# Altium schematic sheet Схема приинципиальная.SchDoc
size 594 x 420 mm; Address1: Address1; Address2: Address2; Address3: Address3; Address4: Address4; DocumentNumber: АБВГ.123456.001 Э3; SheetNumber: 1; Scale: 1:1; DocumentType: Схема электрическая принципиальная; FirstReferrence: АБВГ.123456.001
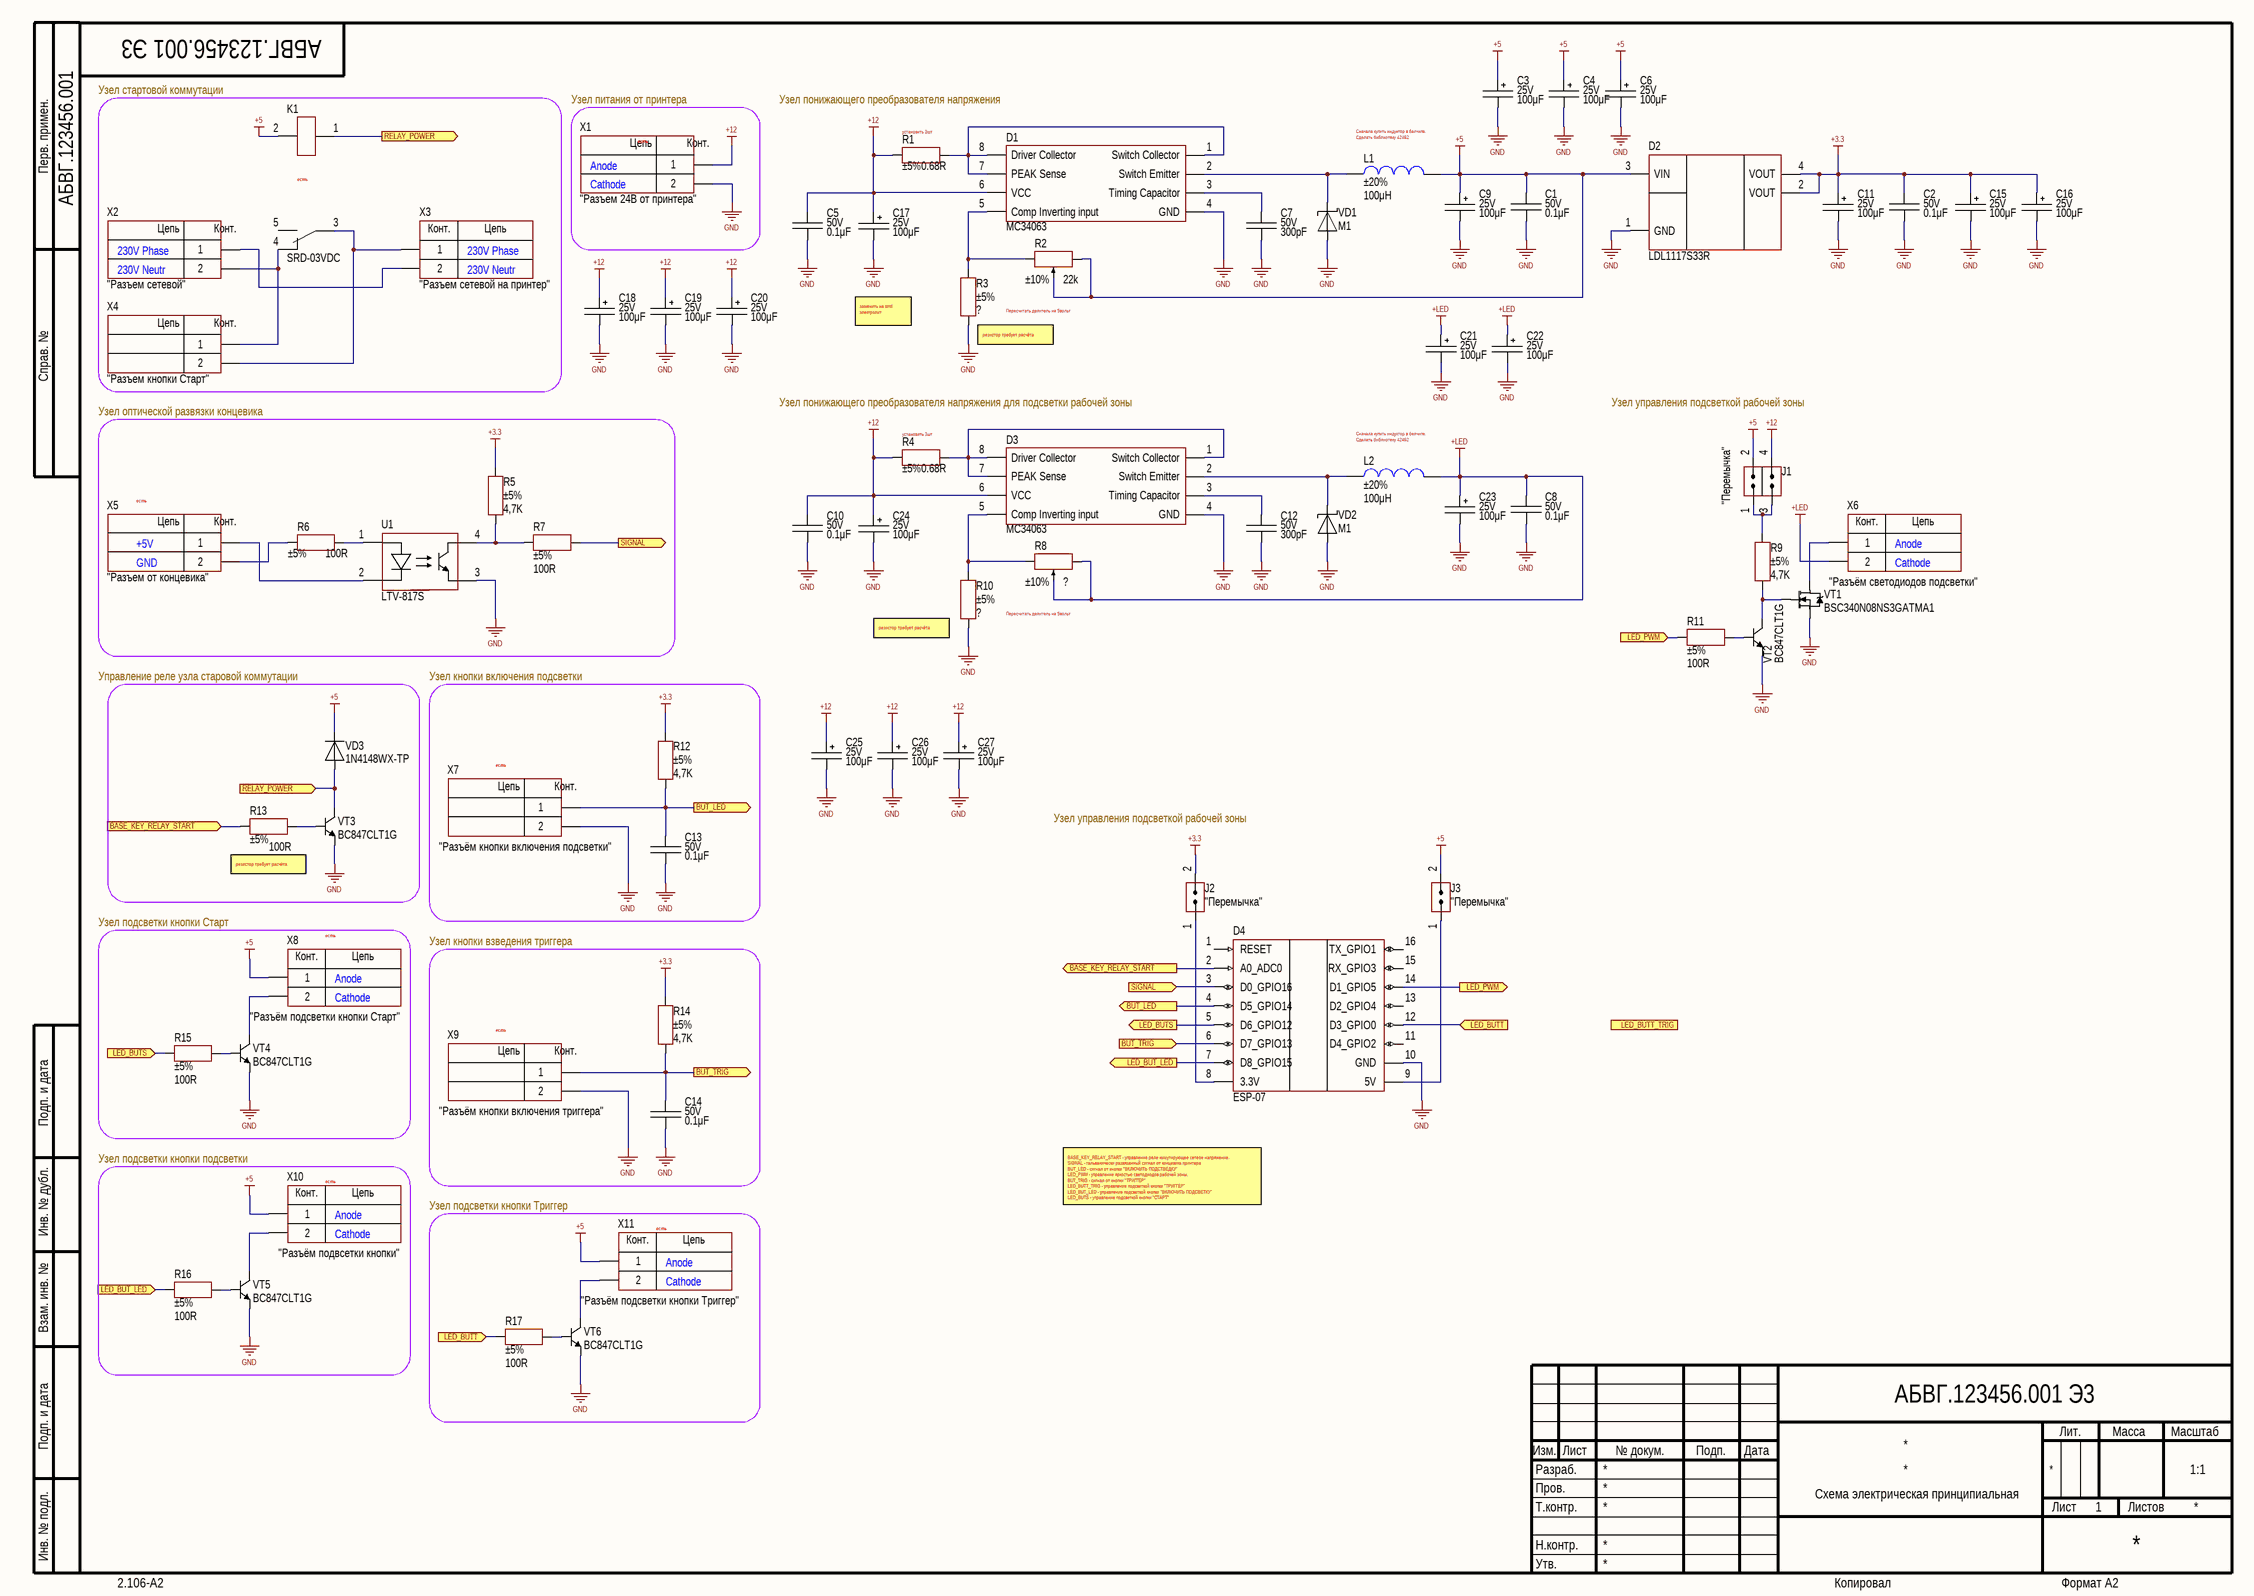
[diagram p0: Схема приинципиальная.SchDoc]

## Parts
C1  value 0.1μF  Voltage: 50V  [CAP: 0603]
C2  value 0.1μF  Voltage: 50V  [CAP: 0603]
C3  value 100μF  Voltage: 25V  [CAP: D6.3C2.5H11]
C4  value 100μF  Voltage: 25V  [CAP: D6.3C2.5H11]
C5  value 0.1μF  Voltage: 50V  [CAP: 0603]
C6  value 100μF  Voltage: 25V  [CAP: D6.3C2.5H11]
C7  value 300pF  Voltage: 50V  [CAP: 0603]
C8  value 0.1μF  Voltage: 50V  [CAP: 0603]
C9  value 100μF  Voltage: 25V  [CAP: D6.3C2.5H11]
C10  value 0.1μF  Voltage: 50V  [CAP: 0603]
C11  value 100μF  Voltage: 25V  [CAP: D6.3C2.5H11]
C12  value 300pF  Voltage: 50V  [CAP: 0603]
C13  value 0.1μF  Voltage: 50V  [CAP: 0603]
C14  value 0.1μF  Voltage: 50V  [CAP: 0603]
C15  value 100μF  Voltage: 25V  [CAP: D6.3C2.5H11]
C16  value 100μF  Voltage: 25V  [CAP: D6.3C2.5H11]
C17  value 100μF  Voltage: 25V  [CAP: D6.3C2.5H11]
C18  value 100μF  Voltage: 25V  [CAP: D6.3C2.5H11]
C19  value 100μF  Voltage: 25V  [CAP: D6.3C2.5H11]
C20  value 100μF  Voltage: 25V  [CAP: D6.3C2.5H11]
C21  value 100μF  Voltage: 25V  [CAP: D6.3C2.5H11]
C22  value 100μF  Voltage: 25V  [CAP: D6.3C2.5H11]
C23  value 100μF  Voltage: 25V  [CAP: D6.3C2.5H11]
C24  value 100μF  Voltage: 25V  [CAP: D6.3C2.5H11]
C25  value 100μF  Voltage: 25V  [CAP: D6.3C2.5H11]
C26  value 100μF  Voltage: 25V  [CAP: D6.3C2.5H11]
C27  value 100μF  Voltage: 25V  [CAP: D6.3C2.5H11]
D1  (no value)  [8-SOIC]
D2  (no value)  [SOT223]
D3  (no value)  [8-SOIC]
D4  PartNumber: ESP-07  [ESP8266MOD D1 mini]
J1  CommentText: "Перемычка"  [CON: JUMPER x2]
J2  CommentText: "Перемычка"  [CON: JUMPER x1]
J3  CommentText: "Перемычка"  [CON: JUMPER x1]
K1  PartNumber: SRD-03VDC  [REL: SRD-03VDC]
L1  value 100μH  Tolerance: ±20%  [CDRH]
L2  value 100μH  Tolerance: ±20%  [CDRH]
R1  value 0.68R  Tolerance: ±5%  [RES: 2512]
R2  value 22k  Tolerance: ±10%  [RES: 3296W]
R3  Tolerance: ±5%  [RES: 0603]
R4  value 0.68R  Tolerance: ±5%  [RES: 2512]
R5  value 4,7K  Tolerance: ±5%  [RES: 0603]
R6  value 100R  Tolerance: ±5%  [RES: 0603]
R7  value 100R  Tolerance: ±5%  [RES: 0603]
R8  Tolerance: ±10%  [RES: 3296W]
R9  value 4,7K  Tolerance: ±5%  [RES: 0603]
R10  Tolerance: ±5%  [RES: 0603]
R11  value 100R  Tolerance: ±5%  [RES: 0603]
R12  value 4,7K  Tolerance: ±5%  [RES: 0603]
R13  value 100R  Tolerance: ±5%  [RES: 0603]
R14  value 4,7K  Tolerance: ±5%  [RES: 0603]
R15  value 100R  Tolerance: ±5%  [RES: 0603]
R16  value 100R  Tolerance: ±5%  [RES: 0603]
R17  value 100R  Tolerance: ±5%  [RES: 0603]
U1  PartNumber: LTV-817S  [4-DIP]
VD1  PartNumber: M1  [DIODE: SMA]
VD2  PartNumber: M1  [DIODE: SMA]
VD3  PartNumber: 1N4148WX-TP  [DIODE: SMA]
VT1  PartNumber: BSC340N08NS3GATMA1  [DPAK]
VT2  PartNumber: BC847CLT1G  [SOT23]
VT3  PartNumber: BC847CLT1G  [SOT23]
VT4  PartNumber: BC847CLT1G  [SOT23]
VT5  PartNumber: BC847CLT1G  [SOT23]
VT6  PartNumber: BC847CLT1G  [SOT23]
X1  CommentText: "Разъем 24В от принтера"  [CON: DG301-5.0-02P-12-00AH]
X2  CommentText: "Разъем сетевой"  [CON: DG301-5.0-02P-12-00AH]
X3  CommentText: "Разъем сетевой на принтер"  [CON: DG301-5.0-02P-12-00AH]
X4  CommentText: "Разъем кнопки Старт"  [CON: DG301-5.0-02P-12-00AH]
X5  CommentText: "Разъем от концевика"  [CON: DG301-5.0-02P-12-00AH]
X6  CommentText: "Разъём светодиодов подсветки"  [CON: DG301-5.0-02P-12-00AH]
X7  CommentText: "Разъём кнопки включения подсветки"  [CON: DG301-5.0-02P-12-00AH]
X8  CommentText: "Разъём подсветки кнопки Старт"  [CON: DG301-5.0-02P-12-00AH]
X9  CommentText: "Разъём кнопки включения триггера"  [CON: DG301-5.0-02P-12-00AH]
X10  CommentText: "Разъём подвсетки кнопки"  [CON: DG301-5.0-02P-12-00AH]
X11  CommentText: "Разъём подсветки кнопки Триггер"  [CON: DG301-5.0-02P-12-00AH]

## Blocks framed on the sheet
Узел кнопки включения подсветки: C13 R12 X7
Узел кнопки взведения триггера: C14 R14 X9

## Ports
BASE_KEY_RELAY_START (in), BASE_KEY_RELAY_START (out), BUT_LED (out), BUT_TRIG (in), BUT_TRIG (out), LED_BUT_LED (in), LED_BUT_LED (out), LED_BUTS (in), LED_BUTS (out), LED_BUTT (in), LED_BUTT_TRIG (out), LED_PWM (in), LED_PWM (out), RELAY_POWER (in), RELAY_POWER (out), SIGNAL (in), SIGNAL (out)

## Nets
+3.3: C2.2 C11.1 C15.1 C16.1 D2.2(VOUT) D2.4(VOUT) J2.2(IN) R5.2 R12.2 R14.2
+5: C1.2 C3.1 C4.1 C6.1 C9.1 D2.3(VIN) J1.2(IN) J3.2(IN) K1.2 L1.1 R2.1 R2.2 VD3.2 X8.1 X10.1 X11.1
+12: C5.2 C10.2 C17.1 C18.1 C19.1 C20.1 C24.1 C25.1 C26.1 C27.1 D1.6(VCC) D3.6(VCC) J1.4(IN) R1.1 R4.1 X1.1
+LED: C8.2 C21.1 C22.1 C23.1 L2.1 R8.1 R8.2 X6.2
GND: C1.1 C2.1 C3.2 C4.2 C5.1 C6.2 C7.1 C8.1 C9.2 C10.1 C11.2 C12.1 C13.1 C14.1 C15.2 C16.2 C17.2 C18.2 C19.2 C20.2 C21.2 C22.2 C23.2 C24.2 C25.2 C26.2 C27.2 D1.4(GND) D2.1(GND) D3.4(GND) D4.10(GND) R3.1 R10.1 U1.3(E) VD1.1 VD2.1 VT1.3(S) VT2.2(E) VT3.2(E) VT4.2(E) VT5.2(E) VT6.2(E) X1.2 X7.2 X9.2
BASE_KEY_RELAY_START: D4.2(A0_ADC0) R13.2 ; port BASE_KEY_RELAY_START
BUT_LED: C13.2 D4.4(D5_GPIO14) R12.1 X7.1 ; port BUT_LED
BUT_TRIG: C14.2 D4.6(D7_GPIO13) R14.1 X9.1 ; port BUT_TRIG
LED_BUT_LED: D4.7(D8_GPIO15) R16.2 ; port LED_BUT_LED
LED_BUTS: D4.5(D6_GPIO12) R15.2 ; port LED_BUTS
LED_BUTT: D4.12(D3_GPIO0) R17.2 ; port LED_BUTT
LED_PWM: D4.14(D1_GPIO5) R11.2 ; port LED_PWM
RELAY_POWER: K1.1 VD3.1 VT3.3(C) ; port RELAY_POWER
SIGNAL: D4.3(D0_GPIO16) R7.1 ; port SIGNAL
NetC7_2: C7.2 D1.3(Timing_Capacitor)
NetC12_2: C12.2 D3.3(Timing_Capacitor)
NetD1_1: D1.1(Switch_Collector) D1.7(PEAK_Sense) D1.8(Driver_Collector) R1.2
NetD1_2: D1.2(Switch_Emitter) L1.2 VD1.2
NetD1_5: D1.5(Comp_Inverting_input) R2.3 R3.2
NetD3_1: D3.1(Switch_Collector) D3.7(PEAK_Sense) D3.8(Driver_Collector) R4.2
NetD3_2: D3.2(Switch_Emitter) L2.2 VD2.2
NetD3_5: D3.5(Comp_Inverting_input) R8.3 R10.2
NetD4_8: D4.8(3.3V) J2.1(IN)
NetD4_9: D4.9(5V) J3.1(IN)
NetJ1_1: J1.1(IN) J1.3(IN) R9.2
NetK1_3: K1.3 X3.1 X4.2
NetK1_4: K1.4 X2.2 X4.1
NetR5_1: R5.1 R7.2 U1.4(C)
NetR6_1: R6.1 X5.2
NetR6_2: R6.2 U1.1(A)
NetR9_1: R9.1 VT1.1(G) VT2.3(C)
NetR11_1: R11.1 VT2.1(B)
NetR13_1: R13.1 VT3.1(B)
NetR15_1: R15.1 VT4.1(B)
NetR16_1: R16.1 VT5.1(B)
NetR17_1: R17.1 VT6.1(B)
NetU1_2: U1.2(C) X5.1
NetVT1_2: VT1.2(D) X6.1
NetVT4_3: VT4.3(C) X8.2
NetVT5_3: VT5.3(C) X10.2
NetVT6_3: VT6.3(C) X11.2
NetX2_1: X2.1 X3.2

Not connected (* = marked no-connect by the designer): D4 1(RESET) 11(D4_GPIO2) 13(D2_GPIO4) 15(RX_GPIO3) 16(TX_GPIO1); K1 5

## Notes on the sheet
- Узел стартовой коммутации
- Узел питания от принтера
- Узел понижающего преобразователя напряжения
- Anode
- есть
- (near R1) установить 3шт
- (near L1) Сначала купить индуктор в белчипе.
  Сделать библиотеку 42492
- (near K1) есть
- Cathode
- 230V Phase
- 230V Neutr
- Пересчитать делитель на 5вольт
- заменить на smd электролит
- (near R3) резистор требует расчёта
- Узел понижающего преобразователя напряжения для подсветки рабочей зоны
- Узел управления подсветкой рабочей зоны
- Узел оптической развязки концевика
- (near R4) установить 3шт
- (near L2) Сначала купить индуктор в белчипе.
  Сделать библиотеку 42492
- +5V
- GND
- (near R10) резистор требует расчёта
- Управление реле узла старовой коммутации
- резистор требует расчёта
- Узел подсветки кнопки Старт
- Узел подсветки кнопки подсветки
- Узел подсветки кнопки Триггер
- BASE_KEY_RELAY_START - управление реле кммутирующее сетеое напряжение.
  SIGNAL - гальванически развязанный сигнал от концевика принтера
  BUT_LED - сигнал от кнопки "ВКЛЮЧИТЬ ПОДСТВЕДКУ"
  LED_PWM - управление яркостью светодиодов рабочей зоны.
  BUT_TRIG - сигнал от кнопки "ТРИГГЕР"
  LED_BUTT_TRIG - управление подсветкой кнопки "ТРИГГЕР"
  LED_BUT_LED - управление подсветкой кнопки "ВКЛЮЧИТЬ ПОДСВЕТКУ"
  LED_BUTS - управление подсветкой кнопки "СТАРТ"
- Перв. примен.
- Справ. №
- Подп. и дата
- Инв. № дубл.
- Взам. инв. №
- Разраб.
- Изм.
- Лист
- № докум.
- Подп.
- Дата
- Лит.
- Масса
- Масштаб
- Пров.
- Т.контр.
- Листов
- Инв. № подл.
- Утв.
- Н.контр.
- 2.106-A2
- Копировал
- Формат А2
- (in symbol Connector_terminal_2pin) Цепь; Конт.

## Library data of the parts
C1 C2 C5 C8 C10 C13 C14 = Ceramic_0603: Manufacturer: Yageo; PartNumber: CC0603KRX7R7BB104; ValueManufacturerPartNumber: Ceramic capacitor, 0.1μF, X7R, ±10%, 50V, 0603, -55...+125°C; TypeCapacitor: Ceramic capacitor; Tolerance: ±10%; TypeDielectric: X7R; Package: 0603; HelpURL: https://www.digikey.com/product-detail/en/yageo/CC0603KRX7R7BB104/311-1088-1-ND/302998; Temperature: -55...+125°C
C3 C4 C6 C9 C11 C15-C27 = Aluminium: Manufacturer: Wurth; PartNumber: 860080475013; ValueManufacturerPartNumber: Aluminium capacitor, 100μF, 25V, ±20%, 54mOhm, 14x10x5 mm, -55...+105°C; TypeCapacitor: Aluminium capacitor; Tolerance: ±20%; Impedance: 54mOhm; Package: 14x10x5 mm; HelpURL: https://www.digikey.com/product-detail/en/wurth-electronics-inc/860080475013/732-9029-1-ND/5728972; Temperature: -55...+105°C
C7 C12 = Ceramic_0603: Manufacturer: Samsung; PartNumber: 01584; ValueManufacturerPartNumber: Ceramic capacitor, 300pF, X7R, ±10%, 50V, 0603, -55...+125°C; TypeCapacitor: Ceramic capacitor; Tolerance: ±10%; TypeDielectric: X7R; Package: 0603; HelpURL: https://belchip.by/product/?selected_product=01584; Temperature: -55...+125°C
D1 D3 = MC34063: DC TO DC CONVERTER / CONTROLLER; Manufacturer: UTC; ValueManufacturerPartNumber: DC TO DC CONVERTER, max supply 40V, Open drain, -40...+105°C, 8-SOIC; VoltageInput: max supply 40V; OutputType: Open drain; HelpURL: https://belchip.by/product/?selected_product=18919; Package: 8-SOIC; ComponentType: DC TO DC CONVERTER; Temperature: -40...+105°C; PartNumber: MC34063
D2 = LDL1117S33R: Linear voltage regulator; Manufacturer: STMicroelectronics; ValueManufacturerPartNumber: Linear voltage regulator, input 3.9...18V, 0.6V, output 3.3V, 1.2A, -40...+85°C, SOT223; VoltageInput: input 3.9...18V; MaxDropout: 0.6V; CurrentOutput: 1.2A; VoltageOutput: output 3.3V; HelpURL: https://www.digikey.com/product-detail/en/stmicroelectronics/LDL1117S33R/497-17239-1-ND/7102079; Package: SOT223; ComponentType: Linear voltage regulator; Temperature: -40...+85°C; PartNumber: LDL1117S33R
D4 = ESP8266MOD D1 mini: module; Manufacturer: Espressif Systems; ValueManufacturerPartNumber: Wi-Fi module, 802.11 b/g/n, 8 bit, SDIO/SPI/UART, -40...+85°C, 21x16mm; Core: 8 bit; TypeInterface: SDIO/SPI/UART; TypeStandart: 802.11 b/g/n; HelpURL: https://www.chipdip.ru/product/esp-07; Package: 21x16mm; ComponentType: Wi-Fi module; Temperature: -40...+85°C
J1 = Jumper_double
J2 J3 = Jumper_single
K1 = Relay_SRD-03VDC: Manufacturer: Ningbo Songle; ValueManufacturerPartNumber: Electromechanics relay, 3VDC, 250VAC, 10A, 1NO, -40...+85°C; TypeRelay: Electromechanics relay; VoltageMax: 250VAC; VoltageControlCoil: 3VDC; MaxCurrent: 10A; Package: 1NO; HelpURL: https://lcsc.com/product-detail/Relays_SRD-03VDC-SL-C_C24585.html; Temperature: -40...+85°C
L1 L2 = Inductor_CDRH: Manufacturer: Bourns; ValueManufacturerPartNumber: Fixed inductor, 100μH, ±20%, CDRH101R, 3A, -40...+150°C; TypeInductor: Fixed inductor; MaxCurrent: 3A; PartNumber: CDRH; Package: CDRH101R; HelpURL: https://aliexpress.ru/item/32956142172.html?spm=a2g0s.9042311.0.0.f06533edih9Buf; Temperature: -40...+150°C
R1 R4 = Resistor_2512: Manufacturer: Yageo; PartNumber: RC2512JK-07100RL; ValueManufacturerPartNumber: Resistor film, 0.68R, ±5%, 2512, 1W, -55...+125°C; TypeResistor: Resistor film; Power: 1W; Package: 2512; HelpURL: https://www.digikey.com/product-detail/en/yageo/RC2512JK-07100RL/YAG3393CT-ND/5962215; Temperature: -55...+125°C
R2 = Trimmer: Manufacturer: Bourns; PartNumber: 3296W-1-103LF; ValueManufacturerPartNumber: Resistor film, 22k, ±10%, 3296W, 0.5W, -55...+125°C; TypeResistor: Resistor film; Power: 0.5W; Package: 3296W; HelpURL: https://www.digikey.com/product-detail/en/bourns-inc/3296W-1-103LF/3296W-103LF-ND/1088045; Temperature: -55...+125°C
R3 R10 = Resistor_0603: Manufacturer: Yageo; PartNumber: RC0603JR-07100RL; ValueManufacturerPartNumber: Resistor film, ?, ±5%, 0603, 0.1W, -55...+125°C; TypeResistor: Resistor film; Power: 0.1W; Package: 0603; HelpURL: https://www.digikey.com/product-detail/en/yageo/RC0603JR-07100RL/311-100GRCT-ND/729644; Temperature: -55...+125°C; Value: ?
R5 R9 R12 R14 = Resistor_0603: Manufacturer: Yageo; PartNumber: RC0603JR-07100RL; ValueManufacturerPartNumber: Resistor film, 4,7K, ±5%, 0603, 0.1W, -55...+125°C; TypeResistor: Resistor film; Power: 0.1W; Package: 0603; HelpURL: https://www.digikey.com/product-detail/en/yageo/RC0603JR-07100RL/311-100GRCT-ND/729644; Temperature: -55...+125°C
R6 R7 R11 R13 R15-R17 = Resistor_0603: Manufacturer: Yageo; PartNumber: RC0603JR-07100RL; ValueManufacturerPartNumber: Resistor film, 100R, ±5%, 0603, 0.1W, -55...+125°C; TypeResistor: Resistor film; Power: 0.1W; Package: 0603; HelpURL: https://www.digikey.com/product-detail/en/yageo/RC0603JR-07100RL/311-100GRCT-ND/729644; Temperature: -55...+125°C
R8 = Trimmer: Manufacturer: Bourns; PartNumber: 3296W-1-103LF; ValueManufacturerPartNumber: Resistor film, ?, ±10%, 3296W, 0.5W, -55...+125°C; TypeResistor: Resistor film; Power: 0.5W; Package: 3296W; HelpURL: https://www.digikey.com/product-detail/en/bourns-inc/3296W-1-103LF/3296W-103LF-ND/1088045; Temperature: -55...+125°C; Value: ?
U1 = LTV-817: Optoisolator; Manufacturer: Lite-On; ValueManufacturerPartNumber: IC optoisolator, 4µs/3µs, 5000Vrms, 35V, -40...+125°C, 4-SMD; Supply: 35V; DataRate: 4µs/3µs; Isolation: 5000Vrms; HelpURL: https://www.digikey.com/product-detail/en/lite-on-inc/LTV-817S/160-1367-5-ND/385837; Package: 4-SMD; ComponentType: IC optoisolator; Temperature: -40...+125°C
VD1 VD2 = Schottky_single: Manufacturer: Diodes Incorporated; ValueManufacturerPartNumber: Schottky diode, 50V, 1000mA, 1V, 15pF, SOD-123, -55...+150°C; TypeDiode: Schottky diode; Voltage: 50V; Current: 1000mA; VoltageDrop: 1V; RecoveryTime: 15pF; Package: SOD-123; HelpURL: https://www.chipdip.by/product/m1-diod?from=suggest_product; Temperature: -55...+150°C
VD3 = Diode_single: Manufacturer: Micro Commercial; ValueManufacturerPartNumber: Single diode, 75V, 150mA, 1V, 4ns, SOD-323, -55...+150°C; TypeDiode: Single diode; Voltage: 75V; Current: 150mA; VoltageDrop: 1V; RecoveryTime: 4ns; Package: SOD-323; HelpURL: https://www.digikey.com/product-detail/en/micro-commercial-co/1N4148WX-TP/1N4148WXTPMSCT-ND/717312; Temperature: -55...+150°C
VT1 = MOSFET_N_123: Manufacturer: Infineon Technologies; ValueManufacturerPartNumber: MOSFET N-channel transistor, 80V, 7A, 9.1nC, 2.5W, 34mOhm, 756pF, 8-TDSON, -55...+150°C; TypeTransistor: MOSFET N-channel transistor; VoltageDS: 80V; CurrentDS: 7A; RDS: 34mOhm; GateCharge: 9.1nC; InputCapacitor: 756pF; MaxPower: 2.5W; Package: 8-TDSON; HelpURL: https://www.digikey.com/product-detail/en/infineon-technologies/BSC340N08NS3GATMA1/BSC340N08NS3GATMA1TR-ND/2080655; Temperature: -55...+150°C
VT2-VT6 = BJT_NPN_132: Manufacturer: ON Semiconductor; ValueManufacturerPartNumber: NPN transistor, 45V, 100mA, 100MHz, 300mW, 0.6V, 420, SOT-23, -55...+125°C; TypeTransistor: NPN transistor; VoltageCE: 45V; CurrentCE: 100mA; VoltageSaturation: 0.6V; Frequency: 100MHz; CurrentGain: 420; MaxPower: 300mW; Package: SOT-23; HelpURL: https://www.digikey.com/product-detail/en/on-semiconductor/BC847CLT1G/BC847CLT1GOSCT-ND/917836; Temperature: -55...+125°C
X1-X11 = Connector_terminal_2pin: Manufacturer: Degson; ValueManufacturerPartNumber: Terminal connector, 2pin, 3.5mm, 300VAC, 10A; PartNumber: DG350-3.5-02P-14; TypeConnector: Terminal connector; VoltageMax: 300VAC; Pitch: 3.5mm; CurrentMax: 10A; Multichannel: 2pin; HelpURL: https://www.chipdip.ru/product/dg350-3.5-02p-12